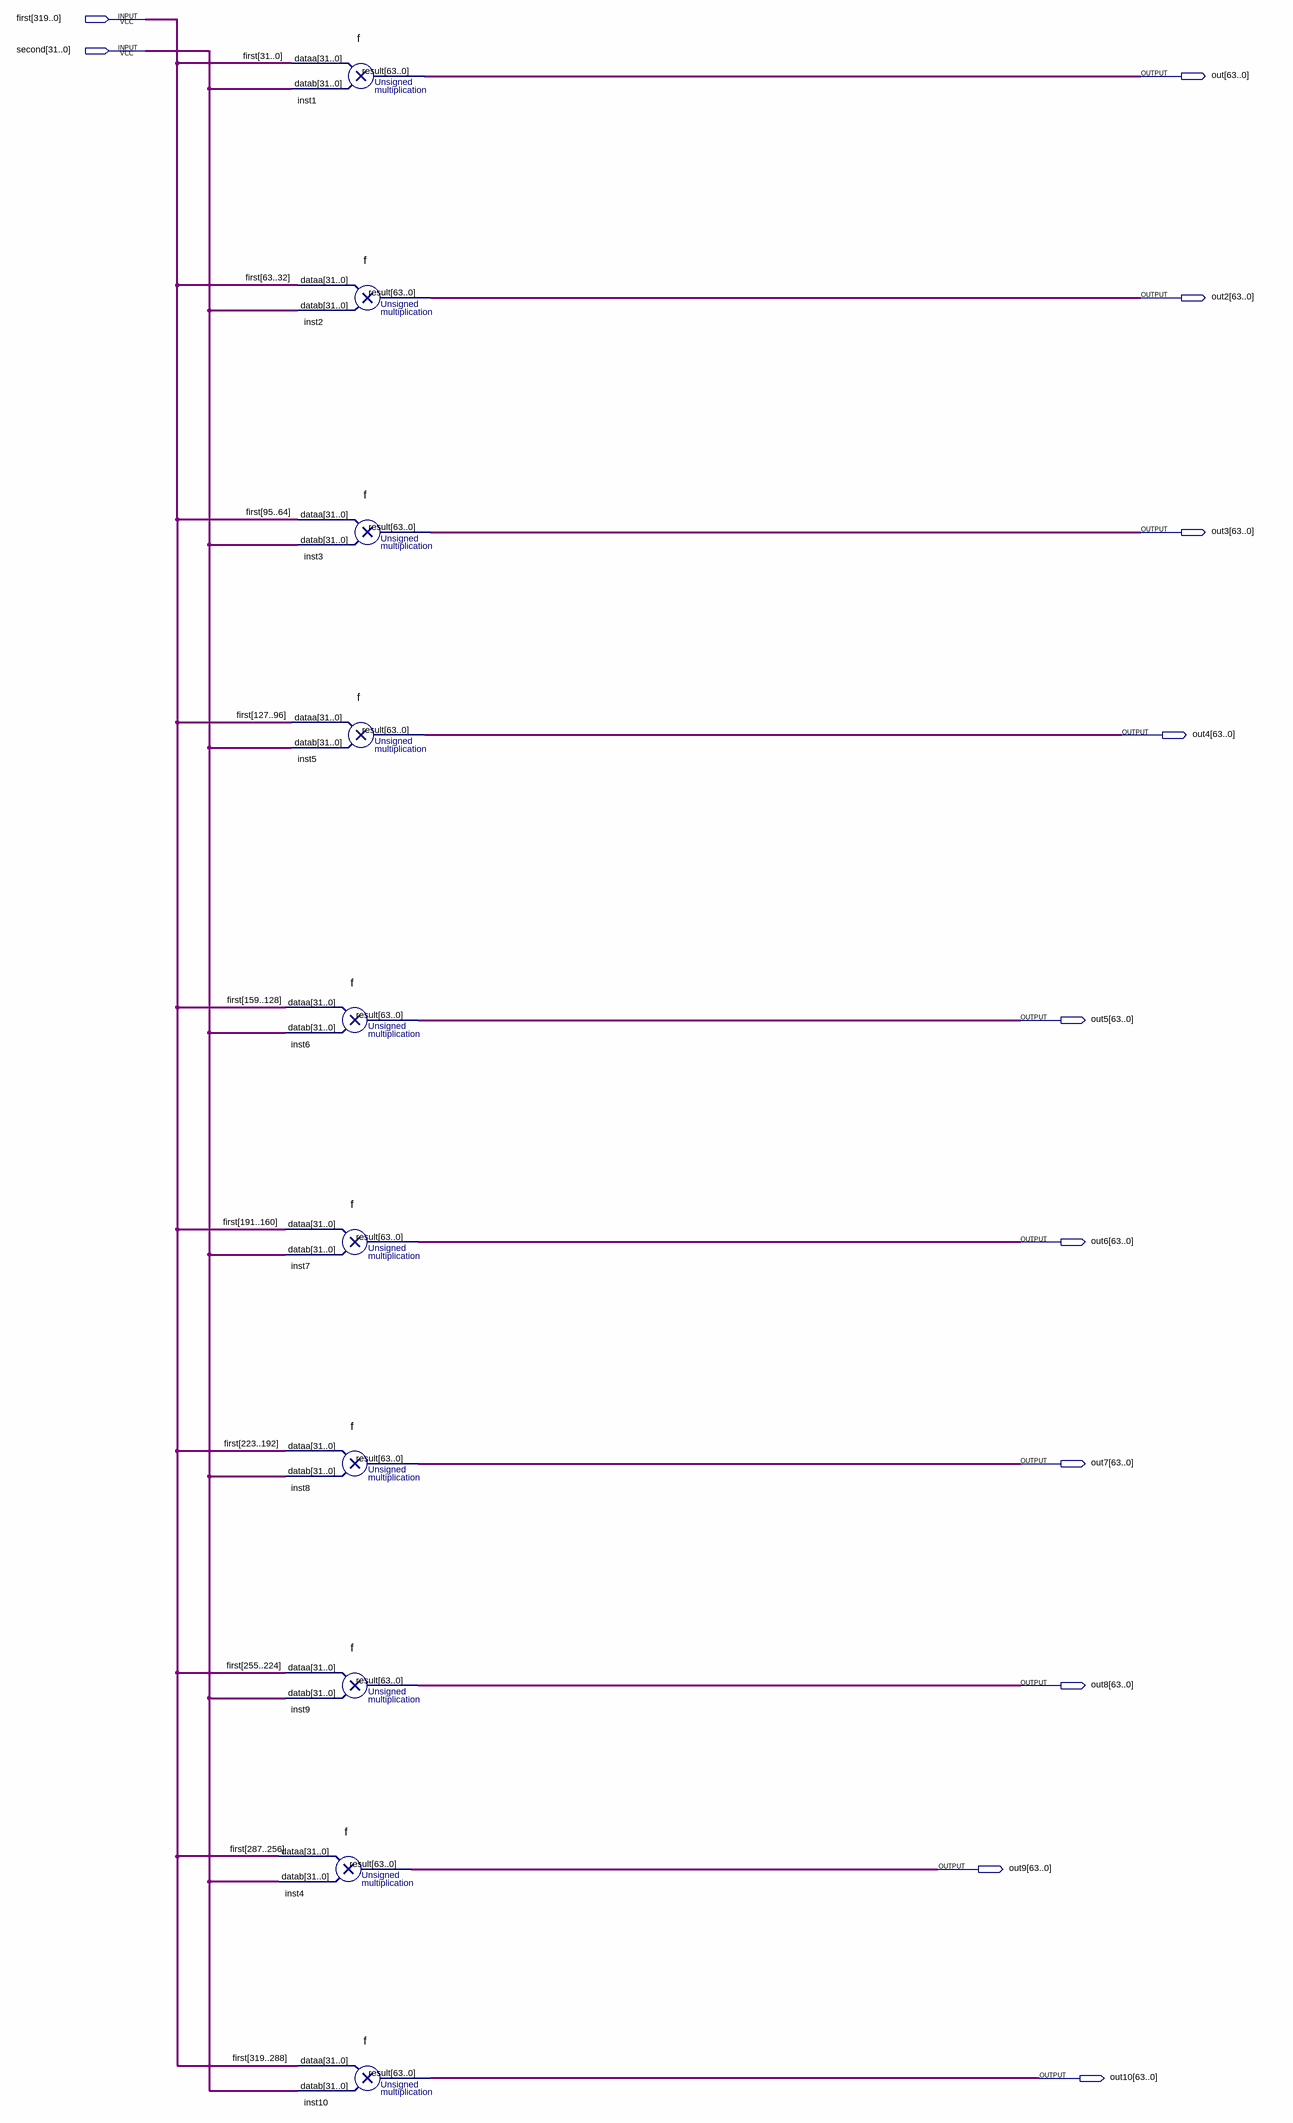
[diagram p0: schematic sheet]
// Quartus schematic MultiplierPolynomial(scalar).bdf as structural Verilog: 10 symbols, 12 pins
module \MultiplierPolynomial(scalar)  (
  input  [319:0] first,
  input  [31:0] second,
  output [63:0] out,
  output [63:0] out2,
  output [63:0] out3,
  output [63:0] out4,
  output [63:0] out5,
  output [63:0] out6,
  output [63:0] out7,
  output [63:0] out8,
  output [63:0] out9,
  output [63:0] out10
);

  f inst1 (.dataa(first[31:0]), .datab(second), .result(out));
  f inst2 (.dataa(first[63:32]), .datab(second), .result(out2));
  f inst3 (.dataa(first[95:64]), .datab(second), .result(out3));
  f inst5 (.dataa(first[127:96]), .datab(second), .result(out4));
  f inst6 (.dataa(first[159:128]), .datab(second), .result(out5));
  f inst7 (.dataa(first[191:160]), .datab(second), .result(out6));
  f inst8 (.dataa(first[223:192]), .datab(second), .result(out7));
  f inst9 (.dataa(first[255:224]), .datab(second), .result(out8));
  f inst4 (.dataa(first[287:256]), .datab(second), .result(out9));
  f inst10 (.dataa(first[319:288]), .datab(second), .result(out10));
endmodule
